# Altium schematic sheet Computation.SchDoc
size A4; SheetNumber: 5; SheetTotal: 5
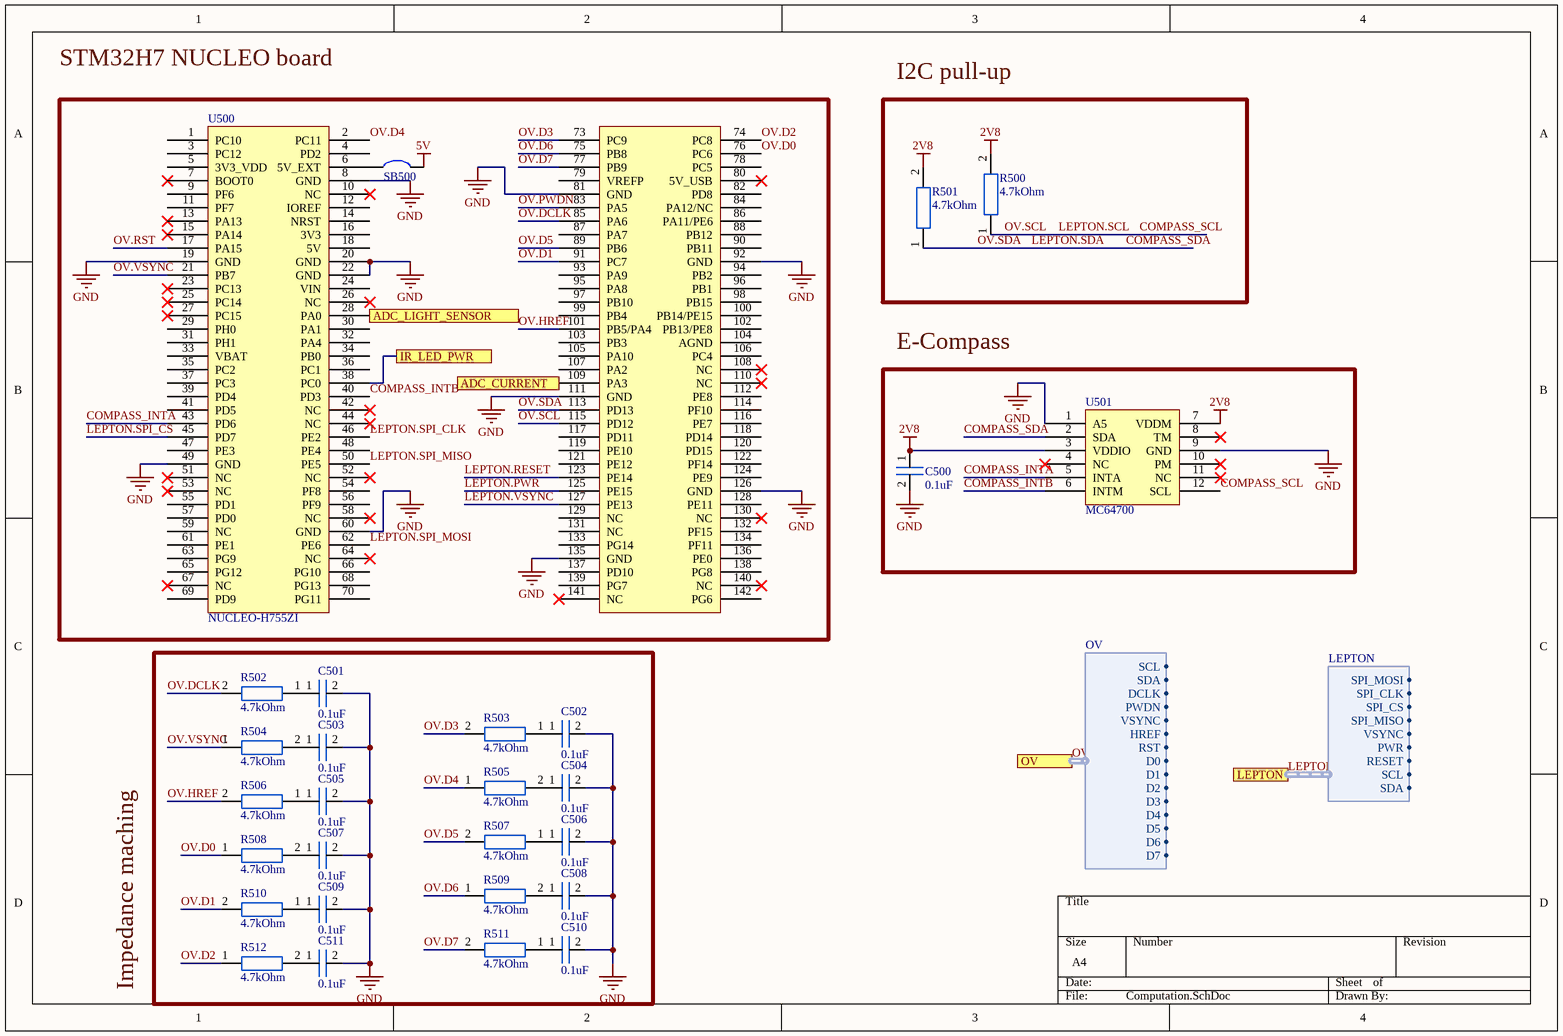
[diagram p0: Computation.SchDoc]

## Parts
C500  0.1uF  [0402_footprint]
C501  0.1uF  [0402_footprint]
C502  0.1uF  [0402_footprint]
C503  0.1uF  [0402_footprint]
C504  0.1uF  [0402_footprint]
C505  0.1uF  [0402_footprint]
C506  0.1uF  [0402_footprint]
C507  0.1uF  [0402_footprint]
C508  0.1uF  [0402_footprint]
C509  0.1uF  [0402_footprint]
C510  0.1uF  [0402_footprint]
C511  0.1uF  [0402_footprint]
R500  4.7kOhm  [0402_footprint]
R501  4.7kOhm  [0402_footprint]
R502  4.7kOhm  [0402_footprint]
R503  4.7kOhm  [0402_footprint]
R504  4.7kOhm  [0402_footprint]
R505  4.7kOhm  [0402_footprint]
R506  4.7kOhm  [0402_footprint]
R507  4.7kOhm  [0402_footprint]
R508  4.7kOhm  [0402_footprint]
R509  4.7kOhm  [0402_footprint]
R510  4.7kOhm  [0402_footprint]
R511  4.7kOhm  [0402_footprint]
R512  4.7kOhm  [0402_footprint]
SB500  Solder_bridge  [SOLDER_BRIDGE]  (value not drawn)
U500  NUCLEO-H755ZI  [H7/H5_NUCLEO_SHIELD]
U501  MC64700  [MC6470]

## Blocks framed on the sheet
I2C pull-up: R500 R501
E-Compass: C500 U501

## Ports
ADC_CURRENT, ADC_LIGHT_SENSOR, IR_LED_PWR, LEPTON (harness LEPTON), OV (harness OV)

## Harnesses
OV: SCL, SDA, DCLK, PWDN, VSYNC, HREF, RST, D0, D1, D2, D3, D4, D5, D6, D7
LEPTON: SPI_MOSI, SPI_CLK, SPI_CS, SPI_MISO, VSYNC, PWR, RESET, SCL, SDA

## Nets
2V8: C500.1 R500.2 R501.2 U501.3(VDDIO) U501.7(VDDM)
5V: SB500.2
GND: C500.2 C501.2 C502.2 C503.2 C504.2 C505.2 C506.2 C507.2 C508.2 C509.2 C510.2 C511.2 U500.8(GND) U500.19(GND) U500.20(GND) U500.22(GND) U500.49(GND) U500.60(GND) U500.81(GND) U500.92(GND) U500.111(GND) U500.126(GND) U500.135(GND) U501.1(A5) U501.9(GND)
ADC_CURRENT: U500.109(PA3) ; port ADC_CURRENT
ADC_LIGHT_SENSOR: U500.28(PA0) ; port ADC_LIGHT_SENSOR
COMPASS_INTA: U500.43(PD6) U501.5(INTA)
COMPASS_INTB: U500.40(PD3) U501.6(INTM)
COMPASS_SCL: R500.1 U500.115(PD12) U501.12(SCL)  [also labelled LEPTON.SCL, OV.SCL]
COMPASS_SDA: R501.1 U500.113(PD13) U501.2(SDA)  [also labelled LEPTON.SDA, OV.SDA]
IR_LED_PWR: U500.38(PC0) ; port IR_LED_PWR
LEPTON.PWR: U500.125(PE15)
LEPTON.RESET: U500.123(PE14)
LEPTON.SPI_CLK: U500.46(PE2)
LEPTON.SPI_CS: U500.45(PD7)
LEPTON.SPI_MISO: U500.50(PE5)
LEPTON.SPI_MOSI: U500.62(PE6)
LEPTON.VSYNC: U500.127(PE13)
OV.D0: R508.1 U500.76(PC6)
OV.D1: R510.2 U500.91(PC7)
OV.D2: R512.1 U500.74(PC8)
OV.D3: R503.2 U500.73(PC9)
OV.D4: R505.1 U500.2(PC11)
OV.D5: R507.2 U500.89(PB6)
OV.D6: R509.1 U500.75(PB8)
OV.D7: R511.2 U500.77(PB9)
OV.DCLK: R502.2 U500.85(PA6)
OV.HREF: R506.2 U500.101(PB5/PA4)
OV.PWDN: U500.83(PA5)
OV.RST: U500.17(PA15)
OV.VSYNC: R504.1 U500.21(PB7)
NetC501_1: C501.1 R502.1
NetC502_1: C502.1 R503.1
NetC503_1: C503.1 R504.2
NetC504_1: C504.1 R505.2
NetC505_1: C505.1 R506.1
NetC506_1: C506.1 R507.1
NetC507_1: C507.1 R508.2
NetC508_1: C508.1 R509.2
NetC509_1: C509.1 R510.1
NetC510_1: C510.1 R511.1
NetC511_1: C511.1 R512.2
NetSB500_1: SB500.1 U500.6(5V_EXT)

Not connected (* = marked no-connect by the designer): U500 1(PC10) 3(PC12) 4(PD2) 5(3V3_VDD) 7(BOOT0)* 9(PF6) 10(NC)* 11(PF7) 12(IOREF) 13(PA13)* 14(NRST) 15(PA14)* 16(3V3) 18(5V) 23(PC13)* 24(VIN) 25(PC14)* 26(NC)* 27(PC15)* 29(PH0) 30(PA1) 31(PH1) 32(PA4) 33(VBAT) 34(PB0) 35(PC2) 36(PC1) 37(PC3) 39(PD4) 41(PD5) 42(NC)* 44(NC)* 47(PE3) 48(PE4) 51(NC)* 52(NC)* 53(NC)* 54(PF8) 55(PD1) 56(PF9) 57(PD0) 58(NC)* 59(NC) 61(PE1) 63(PG9) 64(NC)* 65(PG12) 66(PG10) 67(NC)* 68(PG13) 69(PD9) 70(PG11) 78(PC5) 79(VREFP) 80(5V_USB)* 82(PD8) 84(PA12/NC) 86(PA11/PE6) 87(PA7) 88(PB12) 90(PB11) 93(PA9) 94(PB2) 95(PA8) 96(PB1) 97(PB10) 98(PB15) 99(PB4) 100(PB14/PE15) 102(PB13/PE8) 103(PB3) 104(AGND) 105(PA10) 106(PC4) 107(PA2) 108(NC)* 110(NC)* 112(PE8) 114(PF10) 116(PE7) 117(PD11) 118(PD14) 119(PE10) 120(PD15) 121(PE12) 122(PF14) 124(PE9) 128(PE11) 129(NC) 130(NC)* 131(NC) 132(PF15) 133(PG14) 134(PF11) 136(PE0) 137(PD10) 138(PG8) 139(PG7) 140(NC)* 141(NC)* 142(PG6); U501 4(NC)* 8(TM)* 10(PM)* 11(NC)*

## Buses and harness runs
harness LEPTON = port LEPTON
harness OV = port OV

## Notes on the sheet
- STM32H7 NUCLEO board
- Impedance maching

## Library data of the parts
C500-C511 = Capacitor_0402: 0402 capacitor
R500-R512 = Resistor_0402: 0402 resistor
U500 = NUCLEO-H755ZI: https://www.st.com/en/evaluation-tools/nucleo-h755zi-q.html#documentation; ComponentLink1Description: Datasheet board; ComponentLink1URL: https://www.st.com/resource/en/user_manual/um2408-stm32h7-nucleo144-boards-mb1363-stmicroelectronics.pdf; ComponentLink2Description: Datasheet; ComponentLink2URL: https://www.google.com/url?sa=t&rct=j&q=&esrc=s&source=web&cd=&cad=rja&uact=8&ved=2ahUKEwiL2Oj0qt6BAxVAgv0HHcIABWcQFnoECAkQAQ&url=https%3A%2F%2Fwww.st.com%2Fresource%2Fen%2Fdatasheet%2Fstm32h755bi.pdf&usg=AOvVaw10mo3FsD-TXgt8LL4QIrqK&opi=89978449
U501 = MC64700: 6 axis accelerometer + magnetometer; ComponentLink1Description: Datasheet; ComponentLink1URL: https://www.mouser.lt/datasheet/2/821/MC6470_Datasheet_APS_048_0033v1_7_1-3003085.pdf